# Altium schematic sheet EthIO_02C_MCU_PC_PD.SchDoc
size A4; SheetNumber: 5; SheetTotal: 5
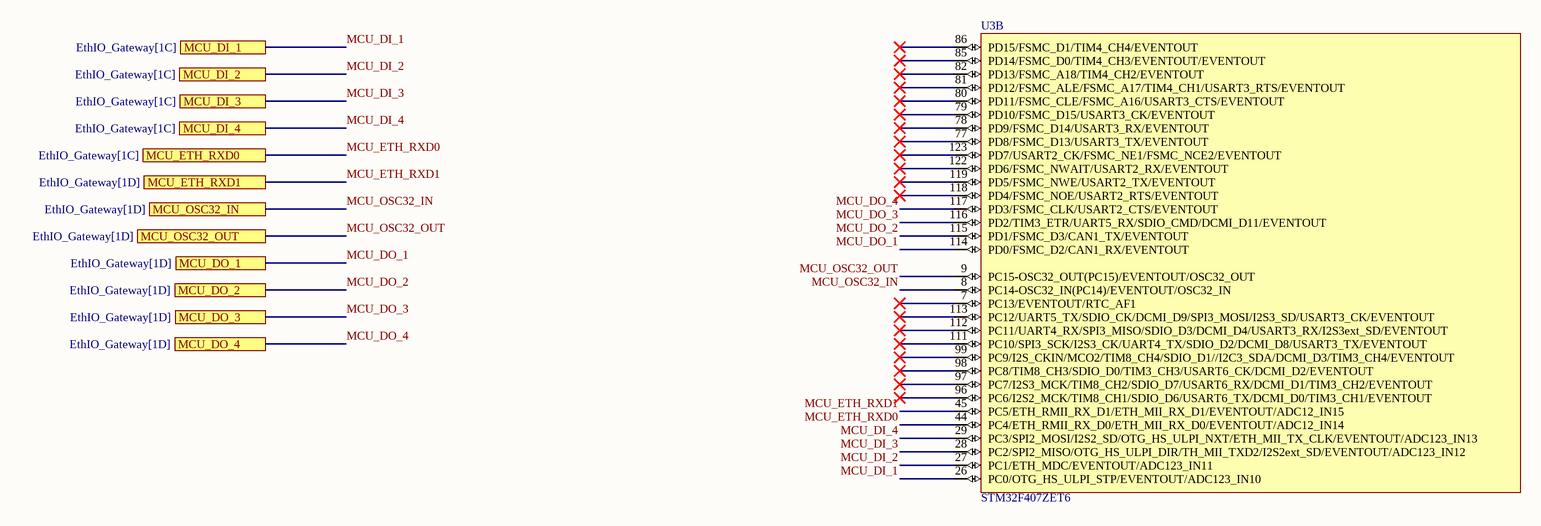
[diagram p0: EthIO_02C_MCU_PC_PD.SchDoc]

## Parts
U3  STM32F407ZET6  [TQFP144_V]  (part B of 5)

## Ports
MCU_DI_1 (see EthIO_Gateway[1C]), MCU_DI_2 (see EthIO_Gateway[1C]), MCU_DI_3 (see EthIO_Gateway[1C]), MCU_DI_4 (see EthIO_Gateway[1C]), MCU_DO_1 (see EthIO_Gateway[1D]), MCU_DO_2 (see EthIO_Gateway[1D]), MCU_DO_3 (see EthIO_Gateway[1D]), MCU_DO_4 (see EthIO_Gateway[1D]), MCU_ETH_RXD0 (see EthIO_Gateway[1C]), MCU_ETH_RXD1 (see EthIO_Gateway[1D]), MCU_OSC32_IN (see EthIO_Gateway[1D]), MCU_OSC32_OUT (see EthIO_Gateway[1D])

## Nets
MCU_DI_1: U3.26(PC0/OTG_HS_ULPI_STP/EVENTOUT/ADC123_IN10) ; port MCU_DI_1
MCU_DI_2: U3.27(PC1/ETH_MDC/EVENTOUT/ADC123_IN11) ; port MCU_DI_2
MCU_DI_3: U3.28(PC2/SPI2_MISO/OTG_HS_ULPI_DIR/TH_MII_TXD2/I2S2ext_SD/EVENTOUT/ADC123_IN12) ; port MCU_DI_3
MCU_DI_4: U3.29(PC3/SPI2_MOSI/I2S2_SD/OTG_HS_ULPI_NXT/ETH_MII_TX_CLK/EVENTOUT/ADC123_IN13) ; port MCU_DI_4
MCU_DO_1: U3.114(PD0/FSMC_D2/CAN1_RX/EVENTOUT) ; port MCU_DO_1
MCU_DO_2: U3.115(PD1/FSMC_D3/CAN1_TX/EVENTOUT) ; port MCU_DO_2
MCU_DO_3: U3.116(PD2/TIM3_ETR/UART5_RX/SDIO_CMD/DCMI_D11/EVENTOUT) ; port MCU_DO_3
MCU_DO_4: U3.117(PD3/FSMC_CLK/USART2_CTS/EVENTOUT) ; port MCU_DO_4
MCU_ETH_RXD0: U3.44(PC4/ETH_RMII_RX_D0/ETH_MII_RX_D0/EVENTOUT/ADC12_IN14) ; port MCU_ETH_RXD0
MCU_ETH_RXD1: U3.45(PC5/ETH_RMII_RX_D1/ETH_MII_RX_D1/EVENTOUT/ADC12_IN15) ; port MCU_ETH_RXD1
MCU_OSC32_IN: U3.8(PC14-OSC32_IN(PC14)/EVENTOUT/OSC32_IN) ; port MCU_OSC32_IN
MCU_OSC32_OUT: U3.9(PC15-OSC32_OUT(PC15)/EVENTOUT/OSC32_OUT) ; port MCU_OSC32_OUT

Not connected (* = marked no-connect by the designer): U3 7(PC13/EVENTOUT/RTC_AF1)* 77(PD8/FSMC_D13/USART3_TX/EVENTOUT)* 78(PD9/FSMC_D14/USART3_RX/EVENTOUT)* 79(PD10/FSMC_D15/USART3_CK/EVENTOUT)* 80(PD11/FSMC_CLE/FSMC_A16/USART3_CTS/EVENTOUT)* 81(PD12/FSMC_ALE/FSMC_A17/TIM4_CH1/USART3_RTS/EVENTOUT)* 82(PD13/FSMC_A18/TIM4_CH2/EVENTOUT)* 85(PD14/FSMC_D0/TIM4_CH3/EVENTOUT/EVENTOUT)* 86(PD15/FSMC_D1/TIM4_CH4/EVENTOUT)* 96(PC6/I2S2_MCK/TIM8_CH1/SDIO_D6/USART6_TX/DCMI_D0/TIM3_CH1/EVENTOUT)* 97(PC7/I2S3_MCK/TIM8_CH2/SDIO_D7/USART6_RX/DCMI_D1/TIM3_CH2/EVENTOUT)* 98(PC8/TIM8_CH3/SDIO_D0/TIM3_CH3/USART6_CK/DCMI_D2/EVENTOUT)* 99(PC9/I2S_CKIN/MCO2/TIM8_CH4/SDIO_D1//I2C3_SDA/DCMI_D3/TIM3_CH4/EVENTOUT)* 111(PC10/SPI3_SCK/I2S3_CK/UART4_TX/SDIO_D2/DCMI_D8/USART3_TX/EVENTOUT)* 112(PC11/UART4_RX/SPI3_MISO/SDIO_D3/DCMI_D4/USART3_RX/I2S3ext_SD/EVENTOUT)* 113(PC12/UART5_TX/SDIO_CK/DCMI_D9/SPI3_MOSI/I2S3_SD/USART3_CK/EVENTOUT)* 118(PD4/FSMC_NOE/USART2_RTS/EVENTOUT)* 119(PD5/FSMC_NWE/USART2_TX/EVENTOUT)* 122(PD6/FSMC_NWAIT/USART2_RX/EVENTOUT)* 123(PD7/USART2_CK/FSMC_NE1/FSMC_NCE2/EVENTOUT)*

## Library data of the parts
U3 = STM32F407ZET6: ARM Cortex-M4 32b MCU+FPU, 210DMIP, 512 kB Flash, 192+4 kB RAM, Camera, 114 I/Os, 144-pin LQFP, -40 to +85癈, Tray; Internal RAM: 192kB; Operating Frequency (Processor Speed): 168MHz; A/D Converter: 24x12-bit; D/A Converter: 2x12-bit; 16-bit Timers (IC/OC/PWM): 12x16-bit(24/24/30); 32-bit Timer (IC/OC/PWM): 2x32-bit (8/8/8); Other Timer Functions: 2xWDG, RTC, 24-bit down counter; Serial Interface: 3xSPI/2xI2S/2xI2C/3xUSART(IrDa, ISO7816)/3xUART/2xUSB OTG FS/HS, 2xCAN/Ethernet MAC10/100, SDIO; 联系卖家，免费查找封装: 唯一出售店铺网址https://shop463601444.taobao.com; DatasheetVersion: rev2, Jan-2012; PackageVersion: 2012; PackageReference: TQFP144; PackageDescription: 144-Pin Low Profile Quad Flat Package, 20x20 mm Body, 0.5 mm Pitch; ComponentLink1Description: Manufacturer URL; ComponentLink1URL: http://www.st.com/; ComponentLink2Description: STM32F405/7 Datasheet; ComponentLink2URL: http://www.st.com/internet/com/TECHNICAL_RESOURCES/TECHNICAL_LITERATURE/DATASHEET/DM00037051.pdf; ComponentLink3Description: STM32F4 Web Page; ComponentLink3URL: http://www.st.com/internet/mcu/subclass/1521.jsp